# Altium schematic sheet Switching_Bridge.SchDoc
size A; SheetNumber: 3; SheetTotal: 4
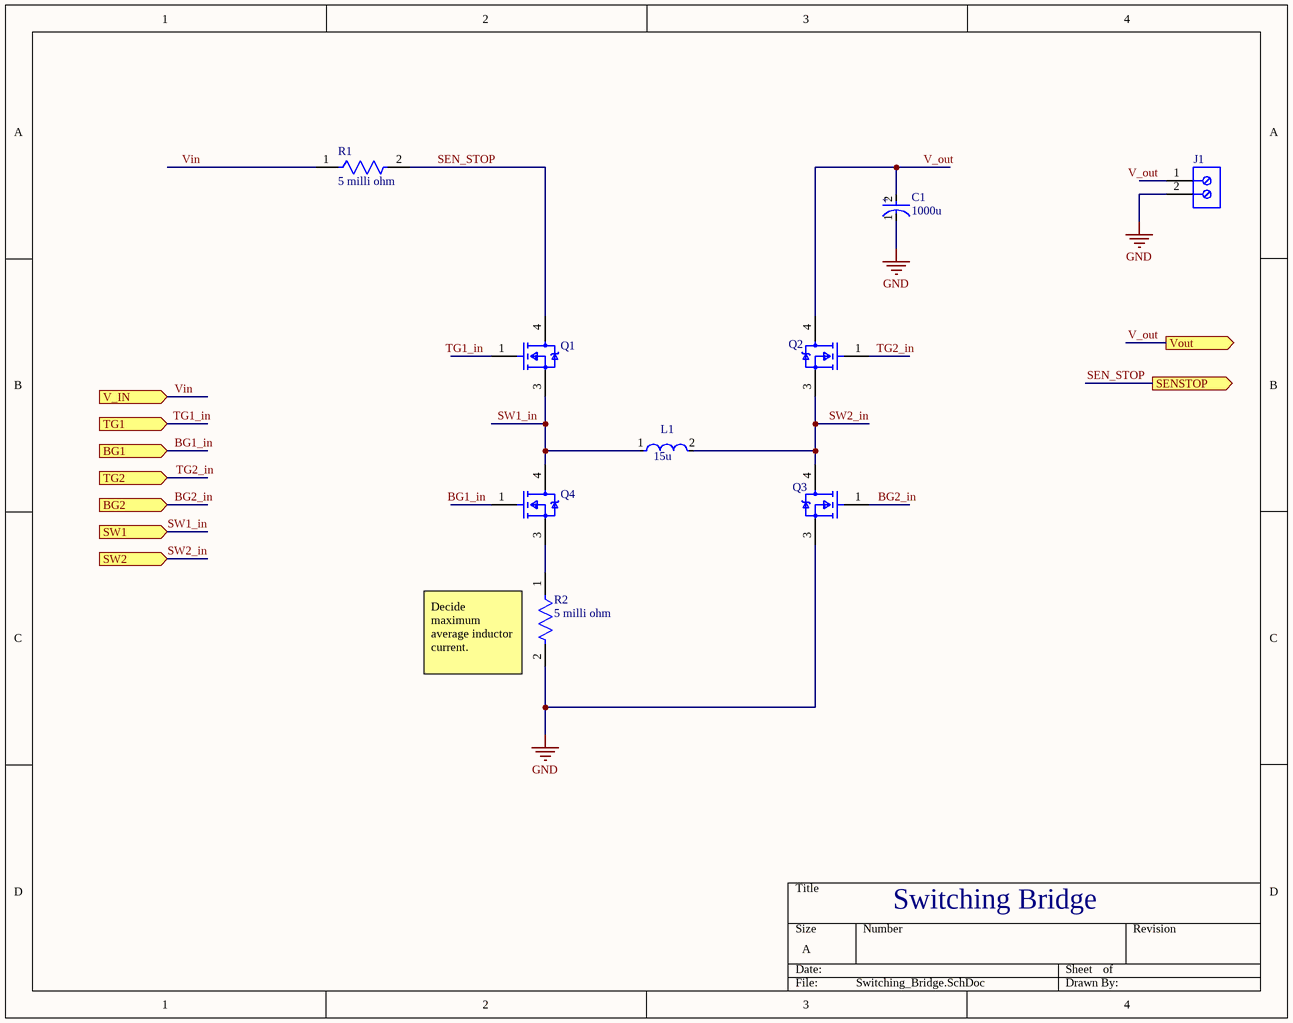
[diagram p0: Switching_Bridge.SchDoc]

## Parts
C1  1000u  [FP-RAD-TH-D_10_0_5-L_25_2-MFG]
J1  691134710002  [691134710002]  (value not drawn)
L1  15u  [FP-SRP1038WA-MFG]
Q1  IRF540NSTRLPBF  [FP-PG-TO263-3-MFG]  (value not drawn)
Q2  IRF540NSTRLPBF  [FP-PG-TO263-3-MFG]  (value not drawn)
Q3  IRF540NSTRLPBF  [FP-PG-TO263-3-MFG]  (value not drawn)
Q4  IRF540NSTRLPBF  [FP-PG-TO263-3-MFG]  (value not drawn)
R1  5 milli ohm  [FP-WSLP2512-0R001-0R0049-MFG]
R2  5 milli ohm  [FP-WSLP2512-0R001-0R0049-MFG]

## Ports
BG1 (in, see Battery_Charger[3C], LTC4020_Controller[4A]), BG2 (in, see Battery_Charger[3C], LTC4020_Controller[4A]), SENSTOP (out, see Battery_Charger[4C], LTC4020_Controller[1A]), SW1 (in, see Battery_Charger[3C], LTC4020_Controller[4A]), SW2 (in, see Battery_Charger[3C], LTC4020_Controller[4A]), TG1 (in, see Battery_Charger[3C], LTC4020_Controller[4A]), TG2 (in, see Battery_Charger[3C], LTC4020_Controller[4A]), V_IN (in, see Battery_Charger[3B], Input_Stage[4B], LTC4020_Controller[1A]), Vout (out, see Battery_Charger[4C], LTC4020_Controller[1A])

## Nets
GND: C1.1(C) J1.2 Q3.3(SOURCE) R2.2
BG1_in: Q4.1(GATE) ; port BG1
BG2_in: Q3.1(GATE) ; port BG2
SEN_STOP: Q1.4(DRAIN) R1.2 ; port SENSTOP
SW1_in: L1.1 Q1.3(SOURCE) Q4.4(DRAIN) ; port SW1
SW2_in: L1.2 Q2.3(SOURCE) Q3.4(DRAIN) ; port SW2
TG1_in: Q1.1(GATE) ; port TG1
TG2_in: Q2.1(GATE) ; port TG2
V_out: C1.2(A) J1.1 Q2.4(DRAIN) ; port Vout
Vin: R1.1 ; port V_IN
NetQ4_3: Q4.3(SOURCE) R2.1

## Notes on the sheet
- (near R2) Decide maximum average inductor current.
- Switching Bridge
- (in symbol CMP-05427-001179-1) +

## Library data of the parts
C1 = CMP-05427-001179-1: Aluminum Electrolytic Capacitors (Radial Lead Type) 1000uF ±20% 35V; Voltage: 25V; ESR (Equivalent Series Resistance): 18mR; Ripple Current: 2.47A; Capacitance: 1mF; Life (Hours): 10000Hour; Polarity: Polar; Lead Diameter: 0.6mm; Lead/Base Style: Straight; Height: 25mm; Tolerance: 20%; Length: 25mm; Voltage Rating (DC): 25V; Mount: Through Hole; RoHS Compliant: Yes; REACH SVHC: No SVHC; Max Operating Temperature: 105°C; Lead Pitch: 5mm; Series: FR; Package Quantity: 200; Contact Plating: Tin; Impedance: 18mR; Packaging: Bulk; Diameter: 10mm; Case/Package: Radial; Termination: Radial; Construction: RADIAL; Voltage Rating: 25V; Min Operating Temperature: -40°C; Radiation Hardening: No; Height - Seated (Max): 1.063inch
J1 = CMP-1502-03295-3: Wire-To-Board Terminal Block, 5mm Pitch, Horizontal, Screw, 2 Poles
L1 = CMP-07248-000131-1: IND,11X10X3.8MM,3.3UH20%,15A,SHD
Q1-Q4 = CMP-00196-65873407-1: IRF540NSTRLPBF Transistor MOSFET N Channel 100 Volt 33 Amp 3-Pin 2+ Tab D2pak Tape And Reel; Drain to Source Voltage (Vdss): 100V; Rise Time: 35ns; Resistance: 44MΩ; Gate to Source Voltage (Vgs): 20V; Turn-Off Delay Time: 39ns; Recovery Time: 170ns; Number of Elements: 1; Max Junction Temperature (Tj): 175°C; Nominal Vgs: 4V; Element Configuration: Single; Current Rating: 33A; Power Dissipation: 3.8W; Turn-On Delay Time: 11ns; Input Capacitance: 1.96nF; Rds On Max: 8.4mΩ; Min Operating Temperature: -55°C; Lead Free: Lead Free; Packaging: Bulk; Voltage Rating (DC): 100V; Radiation Hardening: No; Height: 4.826mm; Schedule B: 8541290080, 8541290080; Mount: Surface Mount; Drain to Source Breakdown Voltage: 100V; Number of Pins: 3; Contact Plating: Tin; NexarPartId: 65873407; Max Operating Temperature: 175°C; Continuous Drain Current (ID): 33A; Termination: SMD/SMT; On-State Resistance: 44mΩ; Threshold Voltage: 4V; RoHS: Compliant; Dual Supply Voltage: 100V; Max Power Dissipation: 3.8W; Lifecycle Status: NRND; Width: 9.65mm; Drain to Source Resistance: 44mΩ; Fall Time: 35ns; Case/Package: D2PAK; Length: 10.668mm; Number of Channels: 1; Package Quantity: 800; REACH SVHC: No SVHC
R1 R2 = CMP-00030-58203087-1: WSLP25122L500FEA SMD Chip Resistor, 5 milli ohm Ohm, ± 1%, 3 W, 2512 [6332 Metric], Metal Strip, Power; NexarPartId: 58203087; RoHS: Non-Compliant